# Altium schematic sheet MCU_NODE.SchDoc
size A
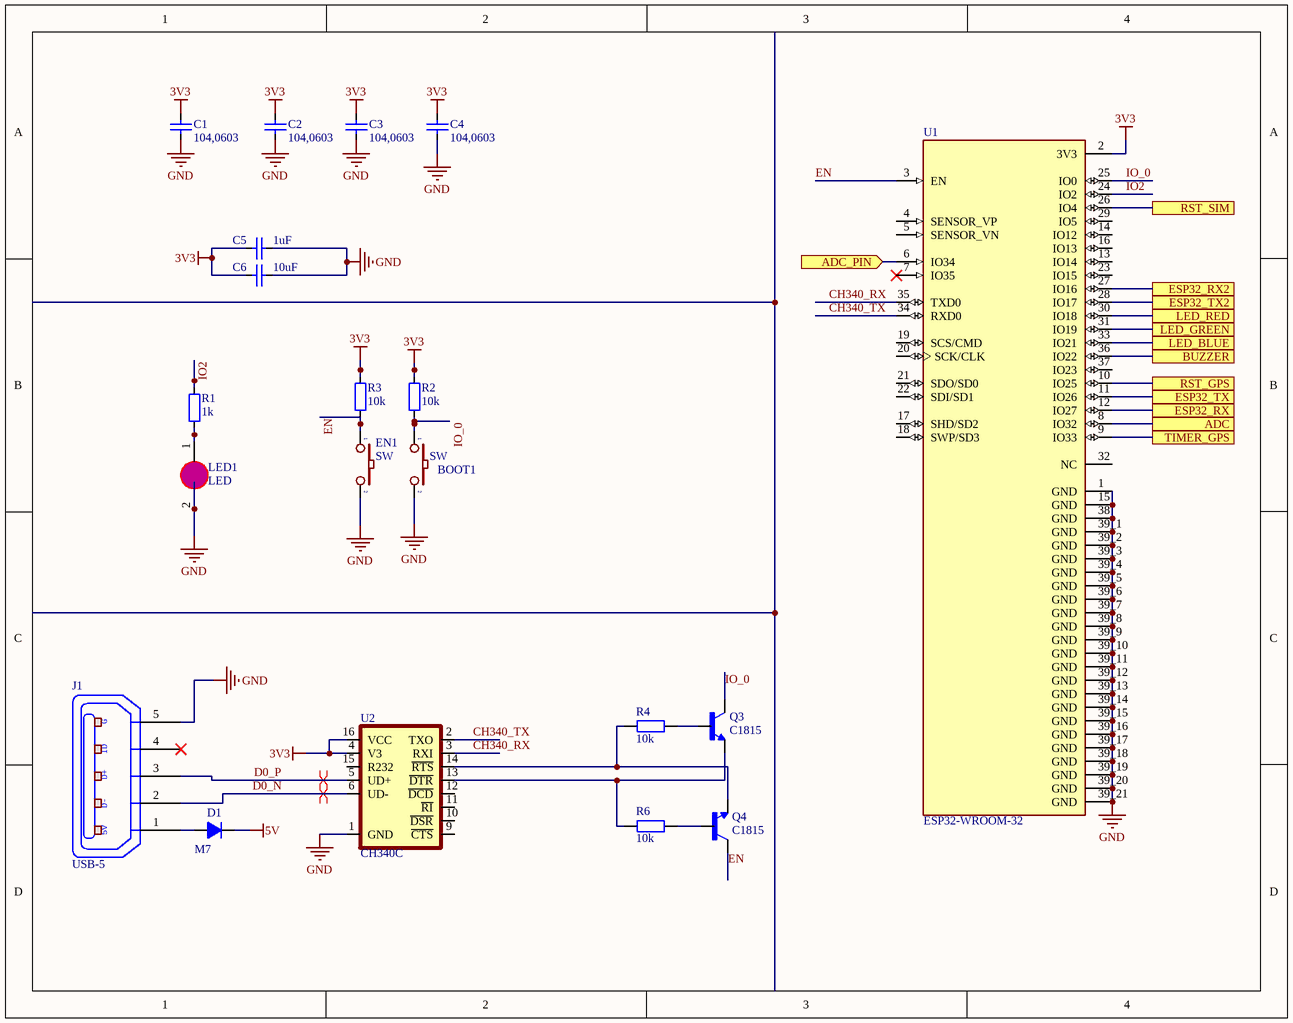
[diagram p0: MCU_NODE.SchDoc]

## Parts
BOOT1  SW  [SW-SMD]
C1  104,0603  [CAP_0603]
C2  104,0603  [CAP_0603]
C3  104,0603  [CAP_0603]
C4  104,0603  [CAP_0603]
C5  1uF  [CAP_0603]
C6  10uF  [CAP_0603]
D1  M7  [SMA]
EN1  SW  [SW-SMD]
J1  USB-5  [USB-M1]
LED1  LED  [LED0805]
Q3  C1815  [SOT95P240X97-3N]
Q4  C1815  [SOT95P240X97-3N]
R1  1k  [RES-SMD-0603]
R2  10k  [RES-SMD-0603]
R3  10k  [RES-SMD-0603]
R4  10k  [RES-SMD-0603]
R6  10k  [RES-SMD-0603]
U1  ESP32-WROOM-32  [MODULE_ESP32-WROOM-32]
U2  CH340C  [SOP-16]

## Ports
ADC, ADC_PIN (in), BUZZER, ESP32_RX, ESP32_RX2, ESP32_TX, ESP32_TX2, LED_BLUE, LED_GREEN, LED_RED, RST_GPS, RST_SIM, TIMER_GPS

## Nets
3V3: C1.2 C2.2 C3.2 C4.2 C5.1 C6.1 R2.1 R3.1 U1.2(3V3) U2.4(V3) U2.16(VCC)
5V: D1.2(K)
GND: BOOT1.2 C1.1 C2.1 C3.1 C4.1 C5.2 C6.2 EN1.2 J1.5(P5) LED1.2(K) U1.1(GND) U1.15(GND) U1.38(GND) U1.39_1(GND) U1.39_2(GND) U1.39_3(GND) U1.39_4(GND) U1.39_5(GND) U1.39_6(GND) U1.39_7(GND) U1.39_8(GND) U1.39_9(GND) U1.39_10(GND) U1.39_11(GND) U1.39_12(GND) U1.39_13(GND) U1.39_14(GND) U1.39_15(GND) U1.39_16(GND) U1.39_17(GND) U1.39_18(GND) U1.39_19(GND) U1.39_20(GND) U1.39_21(GND) U2.1(GND)
ADC: U1.8(IO32) ; port ADC
ADC_PIN: U1.6(IO34) ; port ADC_PIN
BUZZER: U1.36(IO22) ; port BUZZER
CH340_RX: U1.35(TXD0) U2.3(RXI)
CH340_TX: U1.34(RXD0) U2.2(TXO)
D0_N: J1.2(P2) U2.6(UD-)
D0_P: J1.3(P3) U2.5(UD+)
EN: EN1.1 Q4.3(C) R3.2 U1.3(EN)
ESP32_RX: U1.12(IO27) ; port ESP32_RX
ESP32_RX2: U1.27(IO16) ; port ESP32_RX2
ESP32_TX: U1.11(IO26) ; port ESP32_TX
ESP32_TX2: U1.28(IO17) ; port ESP32_TX2
IO2: R1.1 U1.24(IO2)
IO_0: BOOT1.1 Q3.3(C) R2.2 U1.25(IO0)
LED_BLUE: U1.33(IO21) ; port LED_BLUE
LED_GREEN: U1.31(IO19) ; port LED_GREEN
LED_RED: U1.30(IO18) ; port LED_RED
RST_GPS: U1.10(IO25) ; port RST_GPS
RST_SIM: U1.26(IO4) ; port RST_SIM
TIMER_GPS: U1.9(IO33) ; port TIMER_GPS
NetD1_1: D1.1(A) J1.1(P1)
NetLED1_1: LED1.1(A) R1.2
NetQ3_1: Q3.1(B) R4.2
NetQ3_2: Q3.2(E) R6.1 U2.13(~{DTR})
NetQ4_1: Q4.1(B) R6.2
NetQ4_2: Q4.2(E) R4.1 U2.14(~{RTS})

Not connected (* = marked no-connect by the designer): J1 4(P4)*; U1 4(SENSOR_VP) 5(SENSOR_VN) 7(IO35)* 13(IO14) 14(IO12) 16(IO13) 17(SHD/SD2) 18(SWP/SD3) 19(SCS/CMD) 20(SCK/CLK) 21(SDO/SD0) 22(SDI/SD1) 23(IO15) 29(IO5) 32(NC) 37(IO23); U2 9(~{CTS}) 10(~{DSR}) 11(~{RI}) 12(~{DCD}) 15(R232)

## Layout directives
differential pair: D0_N, D0_P

## Notes on the sheet
- (in symbol USB-5) G; ID; D+; D-; 5V

## Library data of the parts
BOOT1 EN1 = SW2: Switch button 2 pin; Value: SW chip 2 pin
C1-C6 = CapSMD: Capacitor; Value: 33p; Published: 8-Jun-2000; LatestRevisionDate: 17-Jul-2002; LatestRevisionNote: Re-released for DXP Platform.; PackageReference: RAD-0.3; Publisher: Altium Limited
D1 = D1A: Diode 1A; Value: 1N4007
J1 = USB-5: Manufacturer: FCI; Manufacturer Part Number: 10118193-0001LF; Connector Type: USB - micro B; Number of Contacts: 5; Gender: Receptacle; Specifications: USB 2.0; .Creator: MM; .Checked PCB: RF; Supplier 1: Digi-Key; RoHS: RoHS Compliant; Category: Connectors, Interconnects; Stock 1: 28642; Pricing 1: 1=0.46, 10=0.433, 25=0.3712, 50=0.3156, 100=0.3032, 250=0.27224, 500=0.25988 (USD); Packaging: Cut Tape (CT); Mounting Type: Surface Mount, Right Angle, Horizontal; Features: Shielded, Solder Retention; Ingress Protection: -; ComponentLink1URL: http://portal.fciconnect.com/Comergent//fci/drawing/10118193.pdf; ComponentLink1Description: http://portal.fciconnect.com/Comergent//fci/drawing/10118193.pdf; Supplier Part Number 1: 609-4616-1-ND; .Checked SCH: MM
LED1 = LED0805: LED SMD 0805
Q3 Q4 = BC817: Bipolar (BJT) Transistor NPN 45V 500mA 100MHz 250mW Surface Mount TO-236AB; MF: Rectron; MP: BC817; Value: *; SnapEDA_Link: https://www.snapeda.com/parts/BC817/Rectron/view-part/?ref=snap; Availability: In Stock; Purchase-URL: https://pricing.snapeda.com/search/part/BC817/?ref=eda; Package: SOT-23-3 Rectron; Price: None; Check_prices: https://www.snapeda.com/parts/BC817/Rectron/view-part/?ref=eda
R1-R4 R6 = Resistor - SMD: Resistor SMD; Manufacturer: Generic Components; Class: Passive; Published: 08/06/2000; Publisher: Altium Hobart Technology Centre
U1 = ESP32-WROOM-32: Bluetooth, WiFi 802.11b/g/n, Bluetooth v4.2 +EDR, Class 1, 2 and 3 Transceiver Module 2.4GHz ~ 2.5GHz Antenna Not Included, U.FL Surface Mount; MF: Espressif Systems; Price: None; Availability: In Stock; MP: ESP32-WROOM-32; Package: Module Espressif Systems; SnapEDA_Link: https://www.snapeda.com/parts/ESP32-WROOM-32/Espressif+Systems/view-part/?ref=snap; Check_prices: https://www.snapeda.com/parts/ESP32-WROOM-32/Espressif+Systems/view-part/?ref=eda; Value: *; Purchase-URL: https://pricing.snapeda.com/search/part/ESP32-WROOM-32/?ref=eda
U2 = CH340C: USB to serial chip CH340; MF: WCH; Package: Package; Check_prices: https://www.snapeda.com/parts/CH340C/WCH/view-part/5428851/?ref=eda; Value: *; Price: None; MP: CH340C; Availability: Unavailable; SnapEDA_Link: https://www.snapeda.com/parts/CH340C/WCH/view-part/5428851/?ref=snap